# EasyEDA Pro project ProPrj_遥控_2025-12-06.epro, schematic Schematic1
Board Name: Board1; Create Date: 2025-05-11; Page Name: P1; Project Name: 遥控; Schematic Name: Schematic1; Update Date: 2025-10-11; Company: 嘉立创EDA; Page Size: A4; Version: V1.0
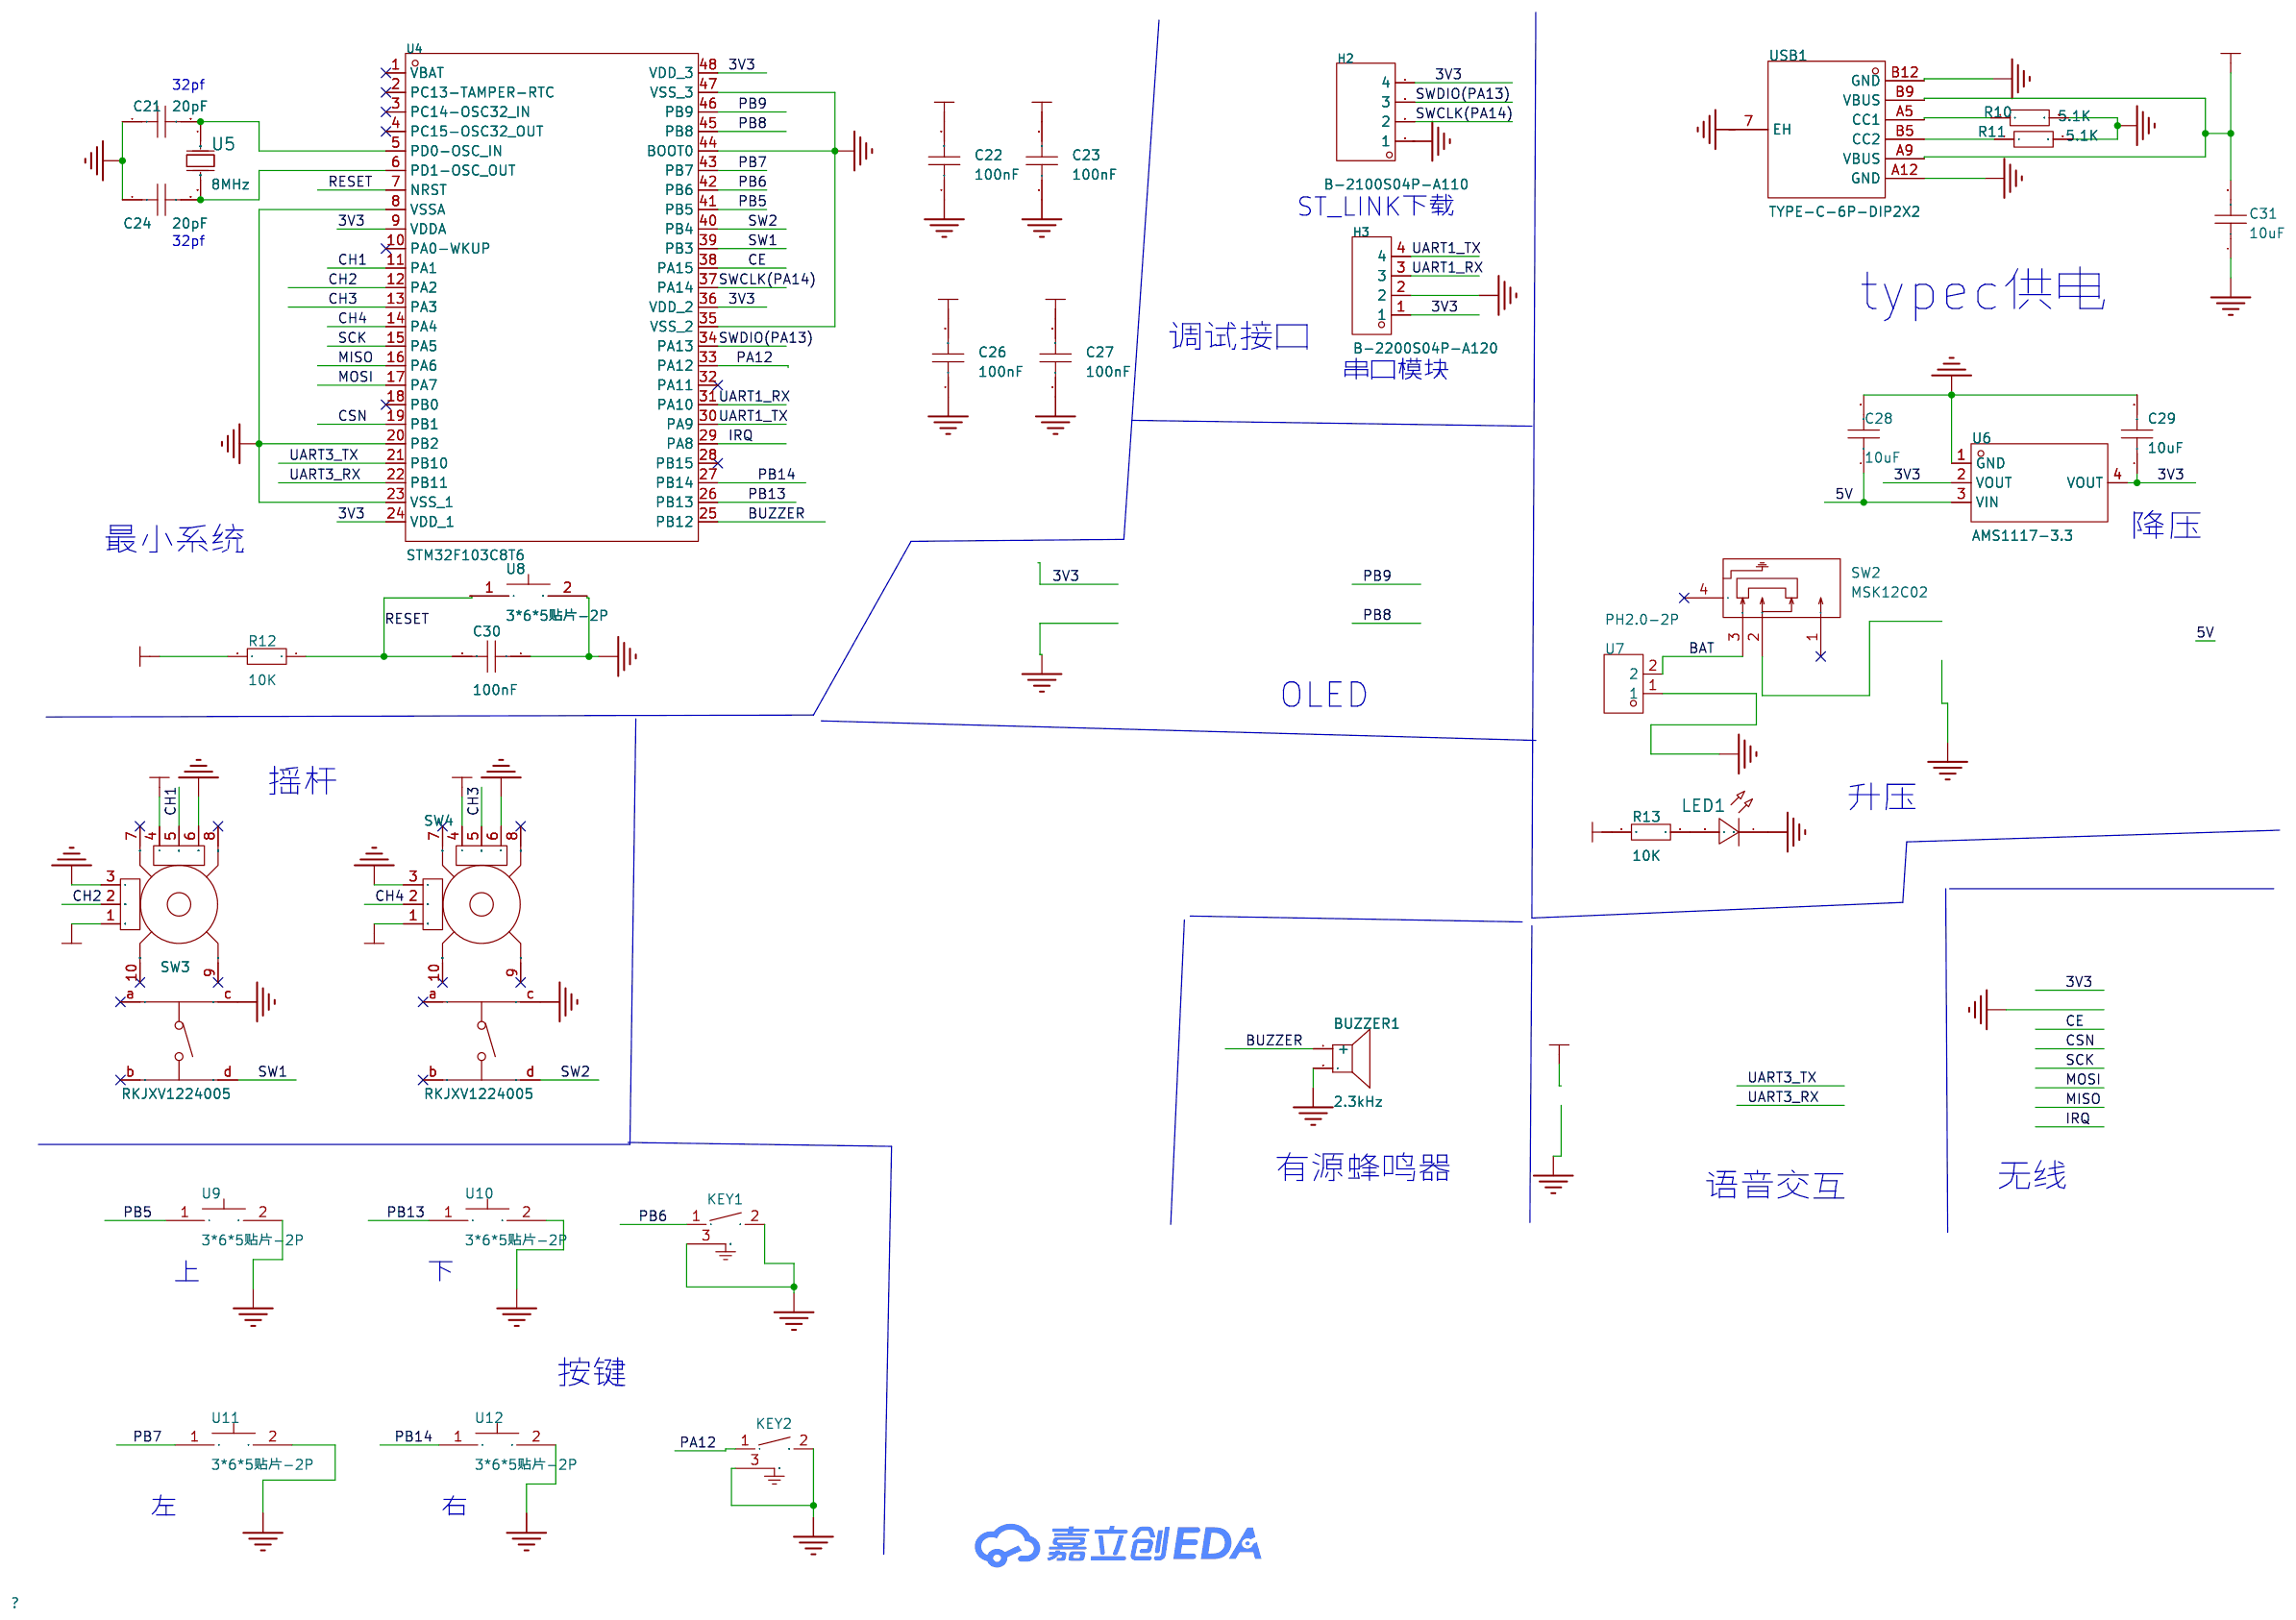
[diagram p6: schematic sheet]

## Parts
BUZZER1  2.3kHz  [BUZ-TH_BD12.0-P7.60-D0.6-FD]
C21  20pF  [C0603]
C22  100nF  [C0603]
C23  100nF  [C0603]
C24  20pF  [C0603]
C26  100nF  [C0603]
C27  100nF  [C0603]
C28  10uF  [C0603]
C29  10uF  [C0603]
C30  100nF  [C0603]
C31  10uF  [C0603]
CBB1  -
CBB2  -
CBB3  -
CBB4  -
H2  B-2100S04P-A110  [HDR-TH_4P-P2.54-V-M]
H3  B-2200S04P-A120  [HDR-TH_4P-P2.54-V-F]
KEY1  博众TS-D009侧按卧式开关  [KEY-TH_TS-1038-A7B3-D2]
KEY2  博众TS-D009侧按卧式开关  [KEY-TH_TS-1038-A7B3-D2]
LED1  -  [LED_0603]
R10  5.1K  [R0603]
R11  5.1K  [R0603]
R12  10K  [R0603]
R13  10K  [R0603]
SW2  MSK12C02  [SW-TH_MSK12C02]
SW3  RKJXV1224005  [SW-TH_RKJXV1224005]
SW4  RKJXV1224005  [SW-TH_RKJXV1224005]
U4  STM32F103C8T6  [LQFP-48_L7.0-W7.0-P0.50-LS9.0-BL]
U5  8MHz  [HC-49S_L11.4-W4.8-LS12.7]
U6  AMS1117-3.3  [SOT-223-3_L6.5-W3.4-P2.30-LS7.0-BR]
U7  PH2.0-2P  [CONN-TH_2P-P2.00_BOSSIE_BX-PH2.0-2PZZ]
U8  3*6*5贴片-2P  [SW-SMD_L6.0-W3.5-LS8.0]
U9  3*6*5贴片-2P  [SW-SMD_L6.0-W3.5-LS8.0]
U10  3*6*5贴片-2P  [SW-SMD_L6.0-W3.5-LS8.0]
U11  3*6*5贴片-2P  [SW-SMD_L6.0-W3.5-LS8.0]
U12  3*6*5贴片-2P  [SW-SMD_L6.0-W3.5-LS8.0]
USB1  TYPE-C-6P-DIP2X2  [TYPE-C-SMD_TYPE-C-6P]

## Library data of the parts
BUZZER1 = TMB12A03: 驱动方式:有源(内含驱动线路);构造类型:电磁式;频率:2.3kHz;声压(SPL):85dB;; Supplier Part: C96222; Manufacturer: 华能; Supplier Footprint: 插件,D=12mm; JLCPCB Part Class: 扩展库; Datasheet: https://item.szlcsc.com/datasheet/TMB12A03/97426.html; Supplier: LCSC; Driver Circuitry: 有源(内含驱动线路); Technology: 电磁式; Voltage - Supply: 1.5V~4V; Sound Pressure Level(SPL): 85dB; Diameter(φD): 12mm; Height: 9.8mm
C21-C24 C26-C31 = CAP_0603: Supplier Footprint: 0603
H2 = B-2100S04P-A110: 排数:单排;总PIN位数:4P;间距:2.54mm;插针结构:1x4P;行距:-;安装类型:直插;圆针/方针:-;额定电流:-;额定电压:-;配合针长度:6mm;塑高:2.54mm;端接针长度:3mm;触头材质:黄铜;触头镀层:-;工作温度范围:-40℃~+105℃;颜色:黑色;; LCSC Part Name: 2.54mm 1x4P 直插; Supplier Part: C124378; Manufacturer: Ckmtw(灿科盟); Supplier Footprint: 插件,P=2.54mm; JLCPCB Part Class: Extended Part; Datasheet: https://atta.szlcsc.com/upload/public/pdf/source/20170821/C124381_1503303309126901535.pdf; Supplier: LCSC; Number of Rows: 单排; Number of Pins: 4P; Pitch: 2.54mm; Pin Structure: 1x4P; Mounting Type: 直插; Length of Mating Pin: 6mm; Insulation Height: 2.54mm; Length of End Connection Pin: 3mm; Contact Material: 黄铜; Operating Temperature Range: -40℃~+105℃; Color: 黑色
H3 = B-2200S04P-A120: 排数:单排;总孔位数:4;间距:2.54mm;插孔结构:1x4P;行距:-;安装类型:直插;塑高:-;触头材质:黄铜;触头镀层:-;; LCSC Part Name: 2.54mm 1x4P; Supplier Part: C124413; Manufacturer: Ckmtw(灿科盟); Supplier Footprint: 直插,P=2.54mm; JLCPCB Part Class: Extended Part; Supplier: LCSC; Number of Rows: 单排; Number of Holes: 4; Pitch: 2.54mm; Holes Structure: 1x4P; Mounting Type: 直插; Contact Material: 黄铜
KEY1 KEY2 = 博众TS-D009侧按卧式开关: Supplier Part: C9900017918; Supplier Footprint: 插件; JLCPCB Part Class: 扩展库; Supplier: LCSC
LED1 = LED_0603-R: Supplier Footprint: 0603
R10-R13 = Res_0603: Supplier Footprint: 0603
SW2 = MSK12C02: 电路结构:单刀双掷;安装方式:卧贴;开关颜色:-;额定电流(DC):50mA;额定电压(DC):12V;额定电流(AC):-;额定电压(AC):-;机械寿命:1万次;; LCSC Part Name: 两档侧拨贴片 7脚 滑动开关; Supplier Part: C431540; Manufacturer: SHOU HAN(首韩); Supplier Footprint: SMD; Datasheet: https://atta.szlcsc.com/upload/public/pdf/source/20190925/C431540_89155AEF0758B9AD1B2D805F83FB12E3.pdf; Supplier: LCSC; Circuit: 单刀双掷; Pin Style: SMD接片; Switch Length: 8mm; Switch Width: 2.8mm; Switch Height: 1.4mm; Mounting Style: 卧贴; Current Rating (DC): 50mA; Voltage Rating (DC): 12V; Mechanical Life: 1万次; Operating Temperature: -20℃~+70℃
SW3 SW4 = RKJXV1224005: 操纵杆复位 中央按动开关 适用于航模玩具遥控器电位器、3D摇杆PS4手柄游戏机、无人机摇杆电位器、工业控制器; Supplier Part: C146170; Manufacturer: ALPSALPINE(阿尔卑斯阿尔派); Supplier Footprint: 插件,13x13mm; JLCPCB Part Class: 扩展库; Datasheet: https://atta.szlcsc.com/upload/public/pdf/source/20180125/C146170_15168615510911301620.pdf; Supplier: LCSC
U4 = STM32F103C8T6: CPU内核:ARM Cortex-M3;CPU最大主频:72MHz;工作电压范围:2V~3.6V;内部振荡器:有;程序 FLASH容量:64K@x8bit;RAM总容量:20KB;EEPROM/数据 FLASH容量:-;GPIO端口数量:37;ADC(单元数/通道数/位数):1@x10ch/12bit;外设/功能/协议栈:看门狗；DMA；看门狗；片载温度传感器;工作温度范围:-40℃~+85℃;; LCSC Part Name: ARM Cortex-M3 72MHz 闪存：64K@x8bit RAM：20KB MSL=3; Supplier Part: C8734; Manufacturer: ST(意法半导体); Supplier Footprint: LQFP-48(7x7); Supplier: LCSC; CPU Core: ARM Cortex-M3; Maximum Frequency: 72MHz; Supply Voltage Range: 2V~3.6V; Internal Oscillator: 有; Program FLASH Size: 64K@x8bit; RAM Size: 20KB; GPIO Ports Number: 37; ADC (Units/Channels/bits): 1@x10ch/12bit; Peripherals / Functions / Protocol Stacks: 看门狗；DMA；看门狗；片载温度传感器; Operating Temperature Range: -40℃~+85℃
U5 = SXMH5.5296F2020F30: 频率:5.5296MHz;频率公差:±20ppm;负载电容:20pF;; LCSC Part Name: 5.5296MHz ±20ppm 20pF; Supplier Part: C2901746; Manufacturer: SCTF(星通时频); Supplier Footprint: HC-49S-SMD; JLCPCB Part Class: 扩展库; Datasheet: https://atta.szlcsc.com/upload/public/pdf/source/20211009/04BD99767F7897B042FCCB7C6CD20611.pdf; Supplier: LCSC; Crystal Type: 贴片无源晶振; Frequency Tolerance: ±20ppm; Frequency Stability: ±30ppm; Load Capacitance: 20pF; Equivalent Series Resistance (ESR): 80Ω; Operating Temperature: -40℃~+85℃
U6 = AMS1117-3.3_C6186: 输出类型:固定;输出极性:正;最大输入电压:-;输出电压:3.3V;输出电流:1A;电源纹波抑制比(PSRR):72dB@(120Hz);; LCSC Part Name: 输出3.3V 1A; Supplier Part: C6186; Manufacturer: AMS; Supplier Footprint: SOT-223; JLCPCB Part Class: 基础库; Datasheet: https://atta.szlcsc.com/upload/public/pdf/source/20180727/C6186_7A095716F0823C02F1997A905E26C086.pdf; Supplier: LCSC; Output Type: 固定; Output Polarity: 正; Number of Outputs: 1; Output Voltage: 3.3V; Dropout Voltage: 1.3V@(800mA); Output Current: 1A; Power Supply Rejection Ratio (PSRR): 72dB@(120Hz)
U7 = PH2.0-2P: Supplier Part: C9900095162; JLCPCB Part Class: 扩展库; Supplier: LCSC
U8-U12 = 3*6*5贴片-2P: Supplier Part: C9900011307; Supplier Footprint: SW-SMD; JLCPCB Part Class: 扩展库; Supplier: LCSC
USB1 = TYPE-C-6P-DIP2X2: Supplier Part: C9900017627; Supplier Footprint: TYPE-C-6P; JLCPCB Part Class: 扩展库; Supplier: LCSC

## Nets
3V3: BUZZER1.2 C21.1 C22.1 C22.2 C23.1 C23.2 C24.1 C26.1 C26.2 C27.1 C27.2 C28.1 C28.2 C29.1 C29.2 C30.1 C31.1 C31.2 CBB1.(OLED_SDA) CBB2.(GND) CBB3.(IRQ) CBB4.(RX) H2.1 H2.4 H3.1 H3.2 KEY1.2 KEY1.3(GND) KEY2.2 KEY2.3(GND) LED1.1(C) R10.2 R11.2 R12.2 R13.2 SW2.2 SW3.1(B) SW3.3(A) SW3.4(A) SW3.6(B) SW3.c SW4.1(B) SW4.3(A) SW4.4(A) SW4.6(B) SW4.c U4.8(VSSA) U4.9(VDDA) U4.15(PA5) U4.16(PA6) U4.17(PA7) U4.19(PB1) U4.20(PB2) U4.21(PB10) U4.22(PB11) U4.23(VSS_1) U4.24(VDD_1) U4.29(PA8) U4.35(VSS_2) U4.36(VDD_2) U4.38(PA15) U4.44(BOOT0) U4.45(PB8) U4.46(PB9) U4.47(VSS_3) U4.48(VDD_3) U6.1(GND) U6.2(VOUT) U6.3(VIN) U6.4(VOUT) U7.1 U8.2 U9.2 U10.2 U11.2 U12.2 USB1.7(EH) USB1.A9(VBUS) USB1.A12(GND) USB1.B9(VBUS) USB1.B12(GND)
BAT: SW2.3 U7.2
BUZZER: BUZZER1.1(+) U4.25(PB12)
CH1: SW3.5(DTA) U4.11(PA1)
CH2: SW3.2(DTA) U4.12(PA2)
CH3: SW4.5(DTA) U4.13(PA3)
CH4: SW4.2(DTA) U4.14(PA4)
PA12: KEY2.1 U4.33(PA12)
PB5: U4.41(PB5) U9.1
PB6: KEY1.1 U4.42(PB6)
PB7: U4.43(PB7) U11.1
PB13: U4.26(PB13) U10.1
PB14: U4.27(PB14) U12.1
RESET: C30.2 R12.1 U4.7(NRST) U8.1
SW1: SW3.d U4.39(PB3)
SW2: SW4.d U4.40(PB4)
SWCLK(PA14): H2.2 U4.37(PA14)
SWDIO(PA13): H2.3 U4.34(PA13)
UART1_RX: H3.3 U4.31(PA10)
UART1_TX: H3.4 U4.30(PA9)
$1N764: C24.2 U4.6(PD1-OSC_OUT) U5.2(OSC2)
$1N765: C21.2 U4.5(PD0-OSC_IN) U5.1(OSC1)
$1N3063: LED1.2(A) R13.1
$1N4986: R11.1 USB1.B5(CC2)
$1N4987: R10.1 USB1.A5(CC1)

Not connected (* = marked no-connect by the designer): SW2 1* 4*; SW3 7(GND)* 8(GND)* 9(GND)* 10(GND)* a* b*; SW4 7(GND)* 8(GND)* 9(GND)* 10(GND)* a* b*; U4 1(VBAT)* 2(PC13-TAMPER-RTC)* 3(PC14-OSC32_IN)* 4(PC15-OSC32_OUT)* 10(PA0-WKUP)* 18(PB0)* 28(PB15)* 32(PA11)*

## Notes on the sheet
- 32pf
- ST_LINK下载
- 32pf
- typec供电
- 调试接口
- 串口模块
- 降压
- 最小系统
- OLED
- 摇杆
- 升压
- 有源蜂鸣器
- 无线
- 语音交互
- 上
- 下
- 按键
- 左
- 右
